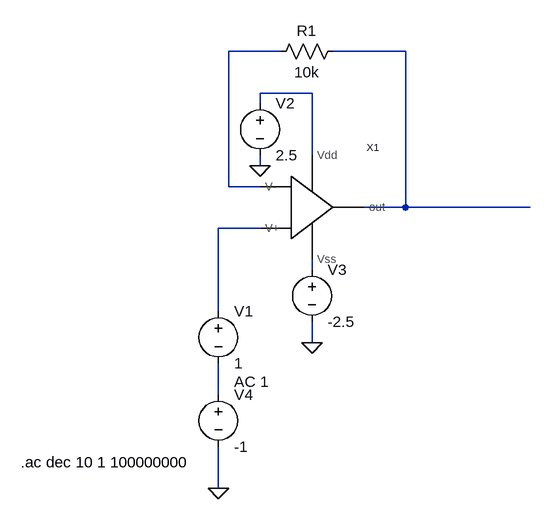
[diagram p0: schematic CMRR.asc]
CMRR.asc, the LTspice schematic file:
Version 4
SHEET 1 880 680
WIRE -128 -160 -208 -160
WIRE 64 -160 -48 -160
WIRE -80 -96 -160 -96
WIRE -160 -80 -160 -96
WIRE -80 0 -80 -96
WIRE -160 16 -160 0
WIRE -208 48 -208 -160
WIRE -160 48 -208 48
WIRE 64 80 64 -160
WIRE 64 80 0 80
WIRE 256 80 64 80
WIRE -160 112 -224 112
WIRE -80 176 -80 160
WIRE -224 240 -224 112
WIRE -80 288 -80 256
WIRE -224 368 -224 320
WIRE -224 512 -224 448
FLAG -80 288 0
FLAG -160 16 0
FLAG -224 512 0
SYMBOL voltage -160 -96 R0
WINDOW 123 0 0 Left 0
WINDOW 39 0 0 Left 0
SYMATTR InstName V2
SYMATTR Value 2.5
SYMBOL voltage -80 160 R0
WINDOW 123 0 0 Left 0
WINDOW 39 0 0 Left 0
SYMATTR InstName V3
SYMATTR Value -2.5
SYMBOL OPAMP -192 80 R0
SYMATTR InstName X1
SYMBOL voltage -224 224 R0
WINDOW 123 24 124 Left 2
WINDOW 39 0 0 Left 0
SYMATTR Value2 AC 1
SYMATTR InstName V1
SYMATTR Value 1
SYMBOL voltage -224 352 R0
WINDOW 123 0 0 Left 0
WINDOW 39 0 0 Left 0
SYMATTR InstName V4
SYMATTR Value -1
SYMBOL res -32 -176 R90
WINDOW 0 0 56 VBottom 2
WINDOW 3 32 56 VTop 2
SYMATTR InstName R1
SYMATTR Value 10k
TEXT -528 472 Left 2 !.ac dec 10 1 100000000

The netlist it stands for:
* CMRR.asc
V2 N003 0 2.5
V3 N005 0 -2.5
XX1 N003 N005 N001 N004 N002 OPAMP  ; pins Vdd Vss V- V+ out
V1 N004 N006 1 AC 1
V4 N006 0 -1
R1 N002 N001 10k
.ac dec 10 1 100000000
.backanno
.end